# Altium schematic sheet Sheet1.SchDoc
size A4; SheetNumber: 1; SheetTotal: 1
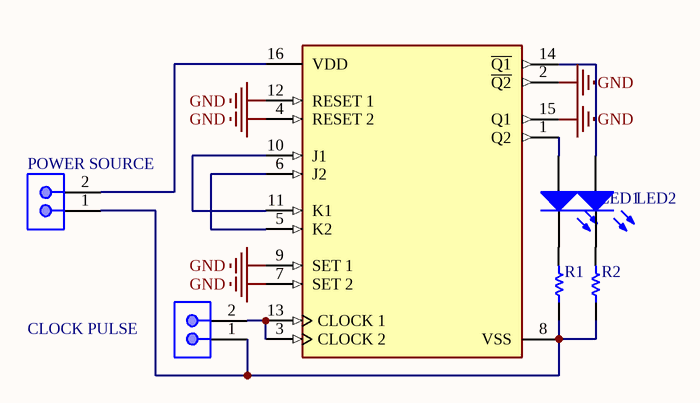
[diagram p0: Sheet1.SchDoc]

## Parts
?  CD4027BE  [JK FLIP FLOP]  (value not drawn)
CLOCK_PULSE  22-27-2021  [PIN]  (value not drawn)
LED1  151051BS04000  [BLUE LED]  (value not drawn)
LED2  151051BS04000  [BLUE LED]  (value not drawn)
POWER_SOURCE  22-27-2021  [PIN]  (value not drawn)
R1  CRCW1210330RJNEA  [330OHM RES]  (value not drawn)
R2  CRCW1210330RJNEA  [330OHM RES]  (value not drawn)

## Nets
GND: ?.2(~{Q2}) ?.4(RESET_2) ?.7(SET_2) ?.9(SET_1) ?.12(RESET_1) ?.15(Q1)
Net?_1: ?.1(Q2) LED1.2(A)
Net?_3: ?.3(CLOCK_2) ?.13(CLOCK_1) CLOCK_PULSE.2
Net?_5: ?.5(K2) ?.6(J2)
Net?_8: ?.8(VSS) CLOCK_PULSE.1 POWER_SOURCE.1 R1.1 R2.1
Net?_10: ?.10(J1) ?.11(K1)
Net?_14: ?.14(~{Q1}) LED2.2(A)
Net?_16: ?.16(VDD) POWER_SOURCE.2
NetLED1_1: LED1.1(K) R1.2
NetLED2_1: LED2.1(K) R2.2

## Library data of the parts
? = JK FLIP FLOP: IC FF JK TYPE DUAL 1BIT 16DIP; Min Supply Voltage: 3V; Input Type: SINGLE-ENDED; Clock Edge Trigger Type: Positive Edge; Output Current: 6.8mA; Polarity: Non-Inverting; High Level Output Current: -4.2mA; Number of Bits per Element: 1; Input Capacitance: 5pF; Operating Supply Voltage: 3.3V; Logic Function: Flip-Flop; Low Level Output Current: 4.2mA; Number of Circuits: 2; Max Frequency: 24MHz; Turn-On Delay Time: 45ns; Propagation Delay: 300ns; Quiescent Current: 20uA; Max Supply Voltage: 18V; Power Dissipation: 500mW; Lead Free: Lead Free; Technology: CMOS; Radiation Hardening: No; Width: 6.35mm; Packaging: Rail/Tube; Height: 4.57mm; Number of Pins: 16; RoHS Compliant: Yes; Contact Plating: Gold; Length: 19.3mm; Number of Elements: 2; Max Operating Temperature: 125°C; Number of Input Lines: 2; Package Quantity: 25; REACH SVHC: No SVHC; Weight: 0.03357oz; Number of Bits: 2; Mount: Through Hole; Min Operating Temperature: -55°C; Number of Output Lines: 1; Case/Package: PDIP; Frequency: 24MHz; Series: 4000B
CLOCK_PULSE POWER_SOURCE = PIN: Male Header, Pitch 2.54 mm, 1 x 2 Position, Height 11.7 mm, Tail Length 3.56 mm, 0 to 75 degC, RoHS, Bulk; Manufacturer: Molex; PartNumber: 0022272021; Current rating: 4A; Package Version: Rev. BC, 02/2012; Voltage rating: 250V; No. of Positions: 2; Pitch: 2.54mm; No. of Rows: 1; Orientation: Vertical; Operating temperature: 0°Cto+75°C; Manufacturer URL: http://www.molex.com/; Mounting Technology: ThroughHole; Housing material: Nylon(UL94V-0); Package Description: 2-Leads Header, Body 5.08 x 5.8 mm, Pitch 2.54 mm; Voltage - Max: 250V; Datasheet URL: http://www.molex.com/pdm_docs/sd/022272021_sd.pdf; Package Reference: 22-27-2021; Contact material: Tinplatedbrass; Current - Max: 4A; Datasheet Version: Rev. F, 06/2009
LED1 LED2 = BLUE LED: THT LED round mono-color color lens, WL-TMRW, Blue; Manufacturer: Wuerth Elektronik; PackageReference: Type 5mm; ComponentLink2Description: Datasheet; ComponentLink1Description: Manufacturer URL; Emitting color: Blue; ComponentLink1URL: http://www.we-online.com; PartNumber: 151051BS04000; ComponentLink2URL: http://katalog.we-online.de/pbs/datasheet/7448042001.pdfhttp://katalog.we-online.de/pbs/datasheet/7448042001.pdfhttp://katalog.we-online.de/pbs/datasheet/7448042001.pdfhttp://katalog.we-online.de/pbs/datasheet/151051BS04000.pdf
R1 R2 = 330OHM RES: Manufacturer: Vishay Dale; Part Number: CRCW1210330RJNEA